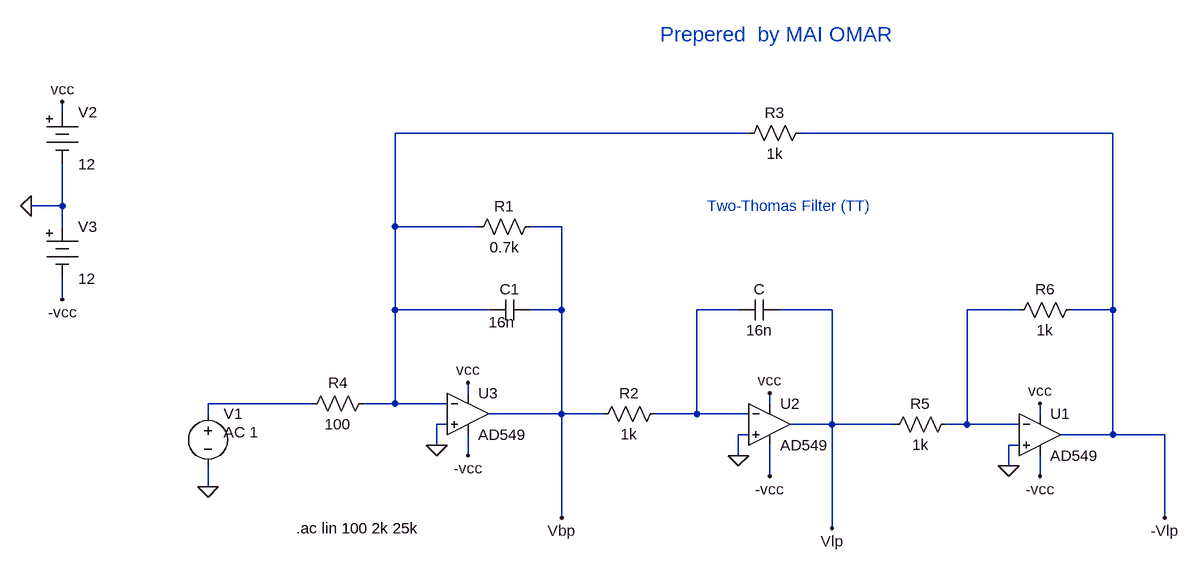
[diagram p0: schematic ass1_TTF_Mai Omar.asc]
ass1_TTF_Mai Omar.asc, the LTspice schematic file:
Version 4
SHEET 1 1008 680
WIRE -768 -944 -768 -960
WIRE 288 -912 -256 -912
WIRE 848 -912 368 -912
WIRE -768 -800 -768 -864
WIRE -768 -800 -816 -800
WIRE -768 -768 -768 -800
WIRE -256 -768 -256 -912
WIRE -128 -768 -256 -768
WIRE 0 -768 -48 -768
WIRE -768 -656 -768 -688
WIRE -256 -640 -256 -768
WIRE -112 -640 -256 -640
WIRE 0 -640 0 -768
WIRE 0 -640 -48 -640
WIRE 272 -640 208 -640
WIRE 416 -640 336 -640
WIRE 704 -640 624 -640
WIRE 848 -640 848 -912
WIRE 848 -640 784 -640
WIRE -144 -512 -144 -528
WIRE -384 -496 -544 -496
WIRE -256 -496 -256 -640
WIRE -256 -496 -304 -496
WIRE -176 -496 -256 -496
WIRE 320 -496 320 -512
WIRE -544 -480 -544 -496
WIRE 0 -480 0 -640
WIRE 0 -480 -112 -480
WIRE 64 -480 0 -480
WIRE 208 -480 208 -640
WIRE 208 -480 144 -480
WIRE 288 -480 208 -480
WIRE 736 -480 736 -496
WIRE -176 -464 -192 -464
WIRE 416 -464 416 -640
WIRE 416 -464 352 -464
WIRE 512 -464 416 -464
WIRE 624 -464 624 -640
WIRE 624 -464 592 -464
WIRE 704 -464 624 -464
WIRE 288 -448 272 -448
WIRE 848 -448 848 -640
WIRE 848 -448 768 -448
WIRE 928 -448 848 -448
WIRE -192 -432 -192 -464
WIRE 704 -432 688 -432
WIRE -144 -416 -144 -448
WIRE 272 -416 272 -448
WIRE 688 -400 688 -432
WIRE 320 -384 320 -432
WIRE 736 -384 736 -416
WIRE -544 -368 -544 -400
WIRE 0 -320 0 -480
WIRE 928 -320 928 -448
WIRE 416 -304 416 -464
FLAG -192 -432 0
FLAG 272 -416 0
FLAG 688 -400 0
FLAG -544 -368 0
FLAG -816 -800 0
FLAG -768 -960 vcc
FLAG -768 -656 -vcc
FLAG -144 -528 vcc
FLAG 320 -512 vcc
FLAG -144 -416 -vcc
FLAG 320 -384 -vcc
FLAG 736 -384 -vcc
FLAG 736 -496 vcc
FLAG 0 -320 Vbp
FLAG 416 -304 Vlp
FLAG 928 -320 -Vlp
SYMBOL res -32 -784 R90
WINDOW 0 0 56 VBottom 2
WINDOW 3 32 56 VTop 2
SYMATTR InstName R1
SYMATTR Value 0.7k
SYMBOL res 160 -496 R90
WINDOW 0 0 56 VBottom 2
WINDOW 3 32 56 VTop 2
SYMATTR InstName R2
SYMATTR Value 1k
SYMBOL res 384 -928 R90
WINDOW 0 0 56 VBottom 2
WINDOW 3 32 56 VTop 2
SYMATTR InstName R3
SYMATTR Value 1k
SYMBOL res -288 -512 R90
WINDOW 0 0 56 VBottom 2
WINDOW 3 32 56 VTop 2
SYMATTR InstName R4
SYMATTR Value 100
SYMBOL res 608 -480 R90
WINDOW 0 0 56 VBottom 2
WINDOW 3 32 56 VTop 2
SYMATTR InstName R5
SYMATTR Value 1k
SYMBOL res 800 -656 R90
WINDOW 0 0 56 VBottom 2
WINDOW 3 32 56 VTop 2
SYMATTR InstName R6
SYMATTR Value 1k
SYMBOL cap -48 -656 R90
WINDOW 0 0 32 VBottom 2
WINDOW 3 19 44 VTop 2
SYMATTR InstName C1
SYMATTR Value 16n
SYMBOL cap 336 -656 R90
WINDOW 0 0 32 VBottom 2
WINDOW 3 32 32 VTop 2
SYMATTR InstName C
SYMATTR Value 16n
SYMBOL Opamps\\AD549 736 -512 R0
SYMATTR InstName U1
SYMBOL Opamps\\AD549 320 -528 R0
SYMATTR InstName U2
SYMBOL Opamps\\AD549 -144 -544 R0
SYMATTR InstName U3
SYMBOL voltage -544 -496 R0
WINDOW 123 24 44 Left 2
WINDOW 39 0 0 Left 0
SYMATTR Value2 AC 1
SYMATTR InstName V1
SYMATTR Value ""
SYMBOL Misc\\battery -768 -960 R0
WINDOW 123 0 0 Left 0
WINDOW 39 0 0 Left 0
SYMATTR InstName V2
SYMATTR Value 12
SYMBOL Misc\\battery -768 -784 R0
WINDOW 123 0 0 Left 0
WINDOW 39 0 0 Left 0
SYMATTR InstName V3
SYMATTR Value 12
TEXT 224 -800 Left 2 ;Two-Thomas Filter (TT)
TEXT -408 -304 Left 2 !.ac lin 100 2k 25k
TEXT 152 -1064 Left 3 ;Prepered  by MAI OMAR

The netlist it stands for:
* ass1_TTF_Mai Omar.asc
R1 Vbp N001 0.7k
R2 N002 Vbp 1k
R3 -Vlp N001 1k
R4 N001 N004 100
R5 N003 Vlp 1k
R6 -Vlp N003 1k
C1 Vbp N001 16n
C Vlp N002 16n
XU1 0 N003 vcc -vcc -Vlp AD549  ; pins In+ In- V+ V- OUT
XU2 0 N002 vcc -vcc Vlp AD549  ; pins In+ In- V+ V- OUT
XU3 0 N001 vcc -vcc Vbp AD549  ; pins In+ In- V+ V- OUT
V1 N004 0 AC 1
V2 vcc 0 12
V3 0 -vcc 12
* Two-Thomas Filter (TT)
.ac lin 100 2k 25k
* Prepered  by MAI OMAR
.backanno
.end